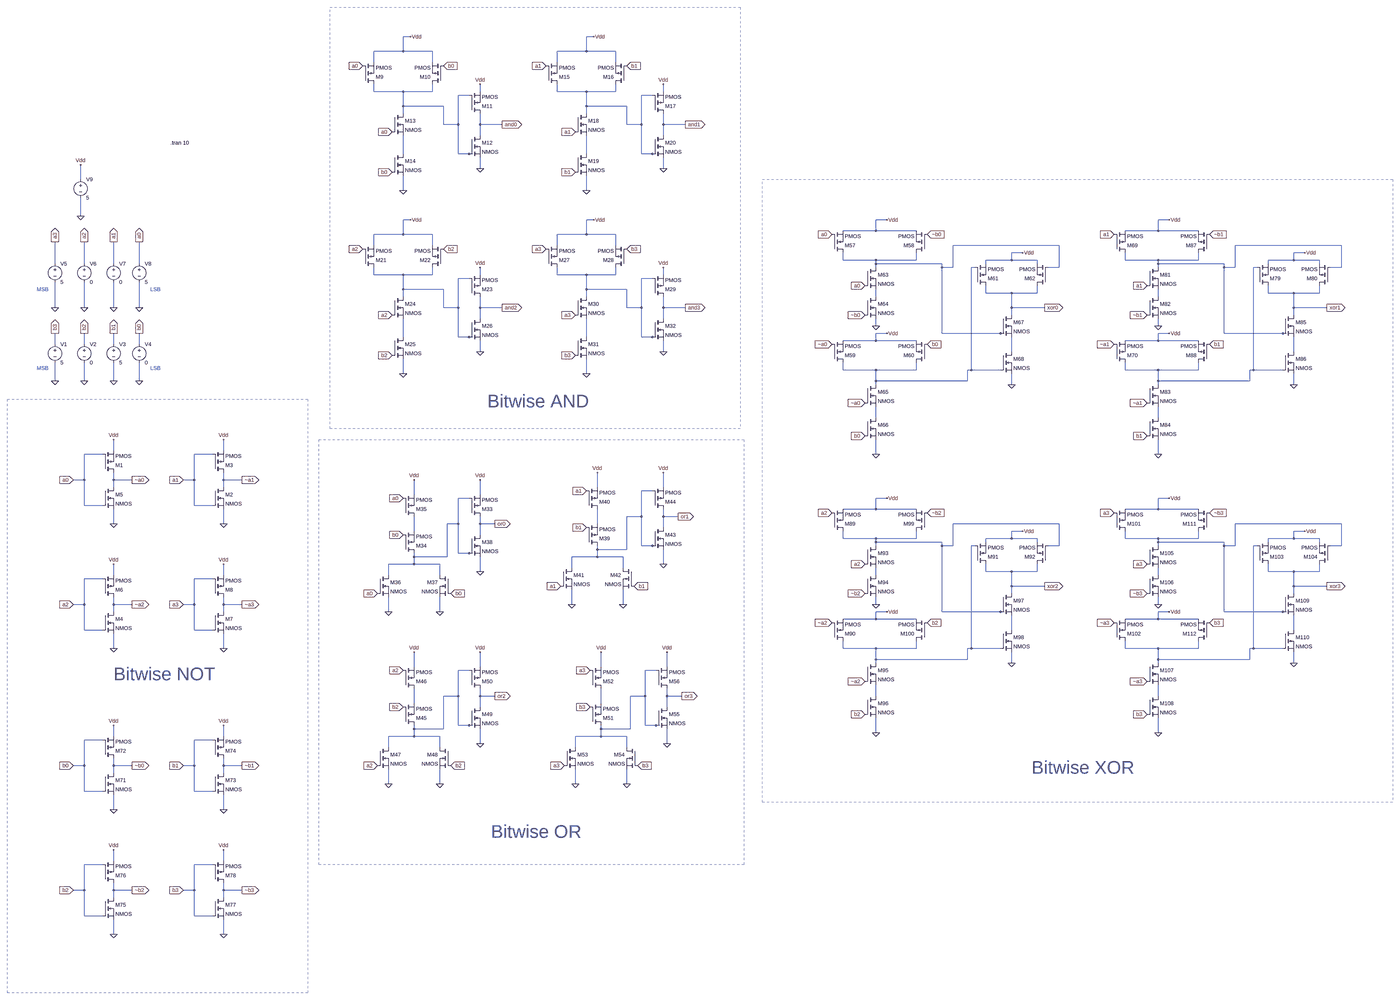
[diagram p0: schematic Bitwise Basic Gate operations.asc, whole sheet]
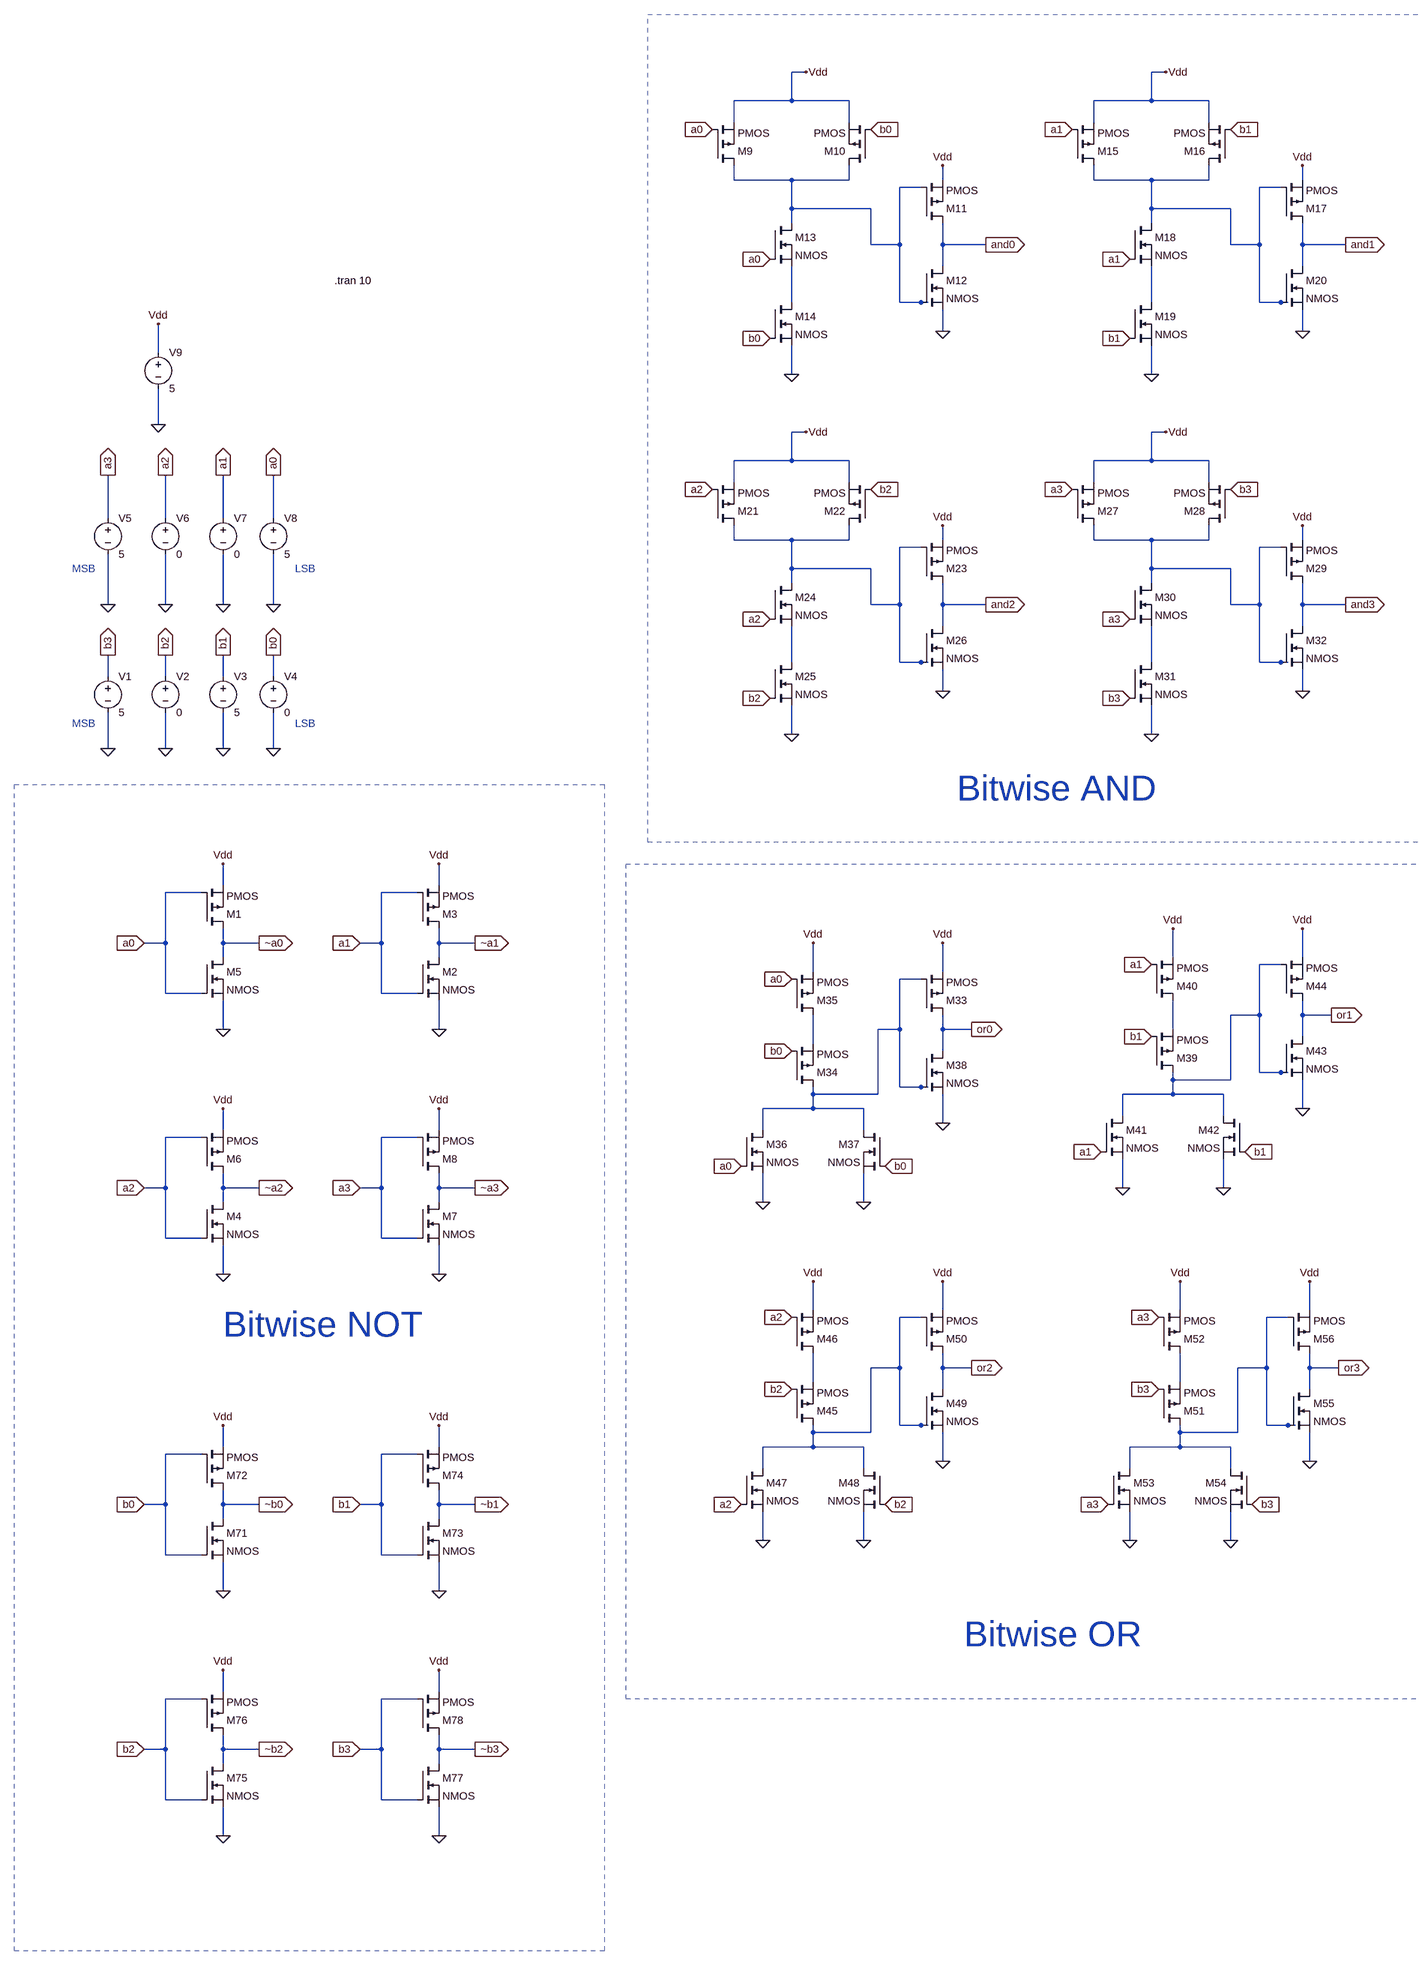
[diagram p1: schematic Bitwise Basic Gate operations.asc, part, row 1 of 1, column 1 of 2]
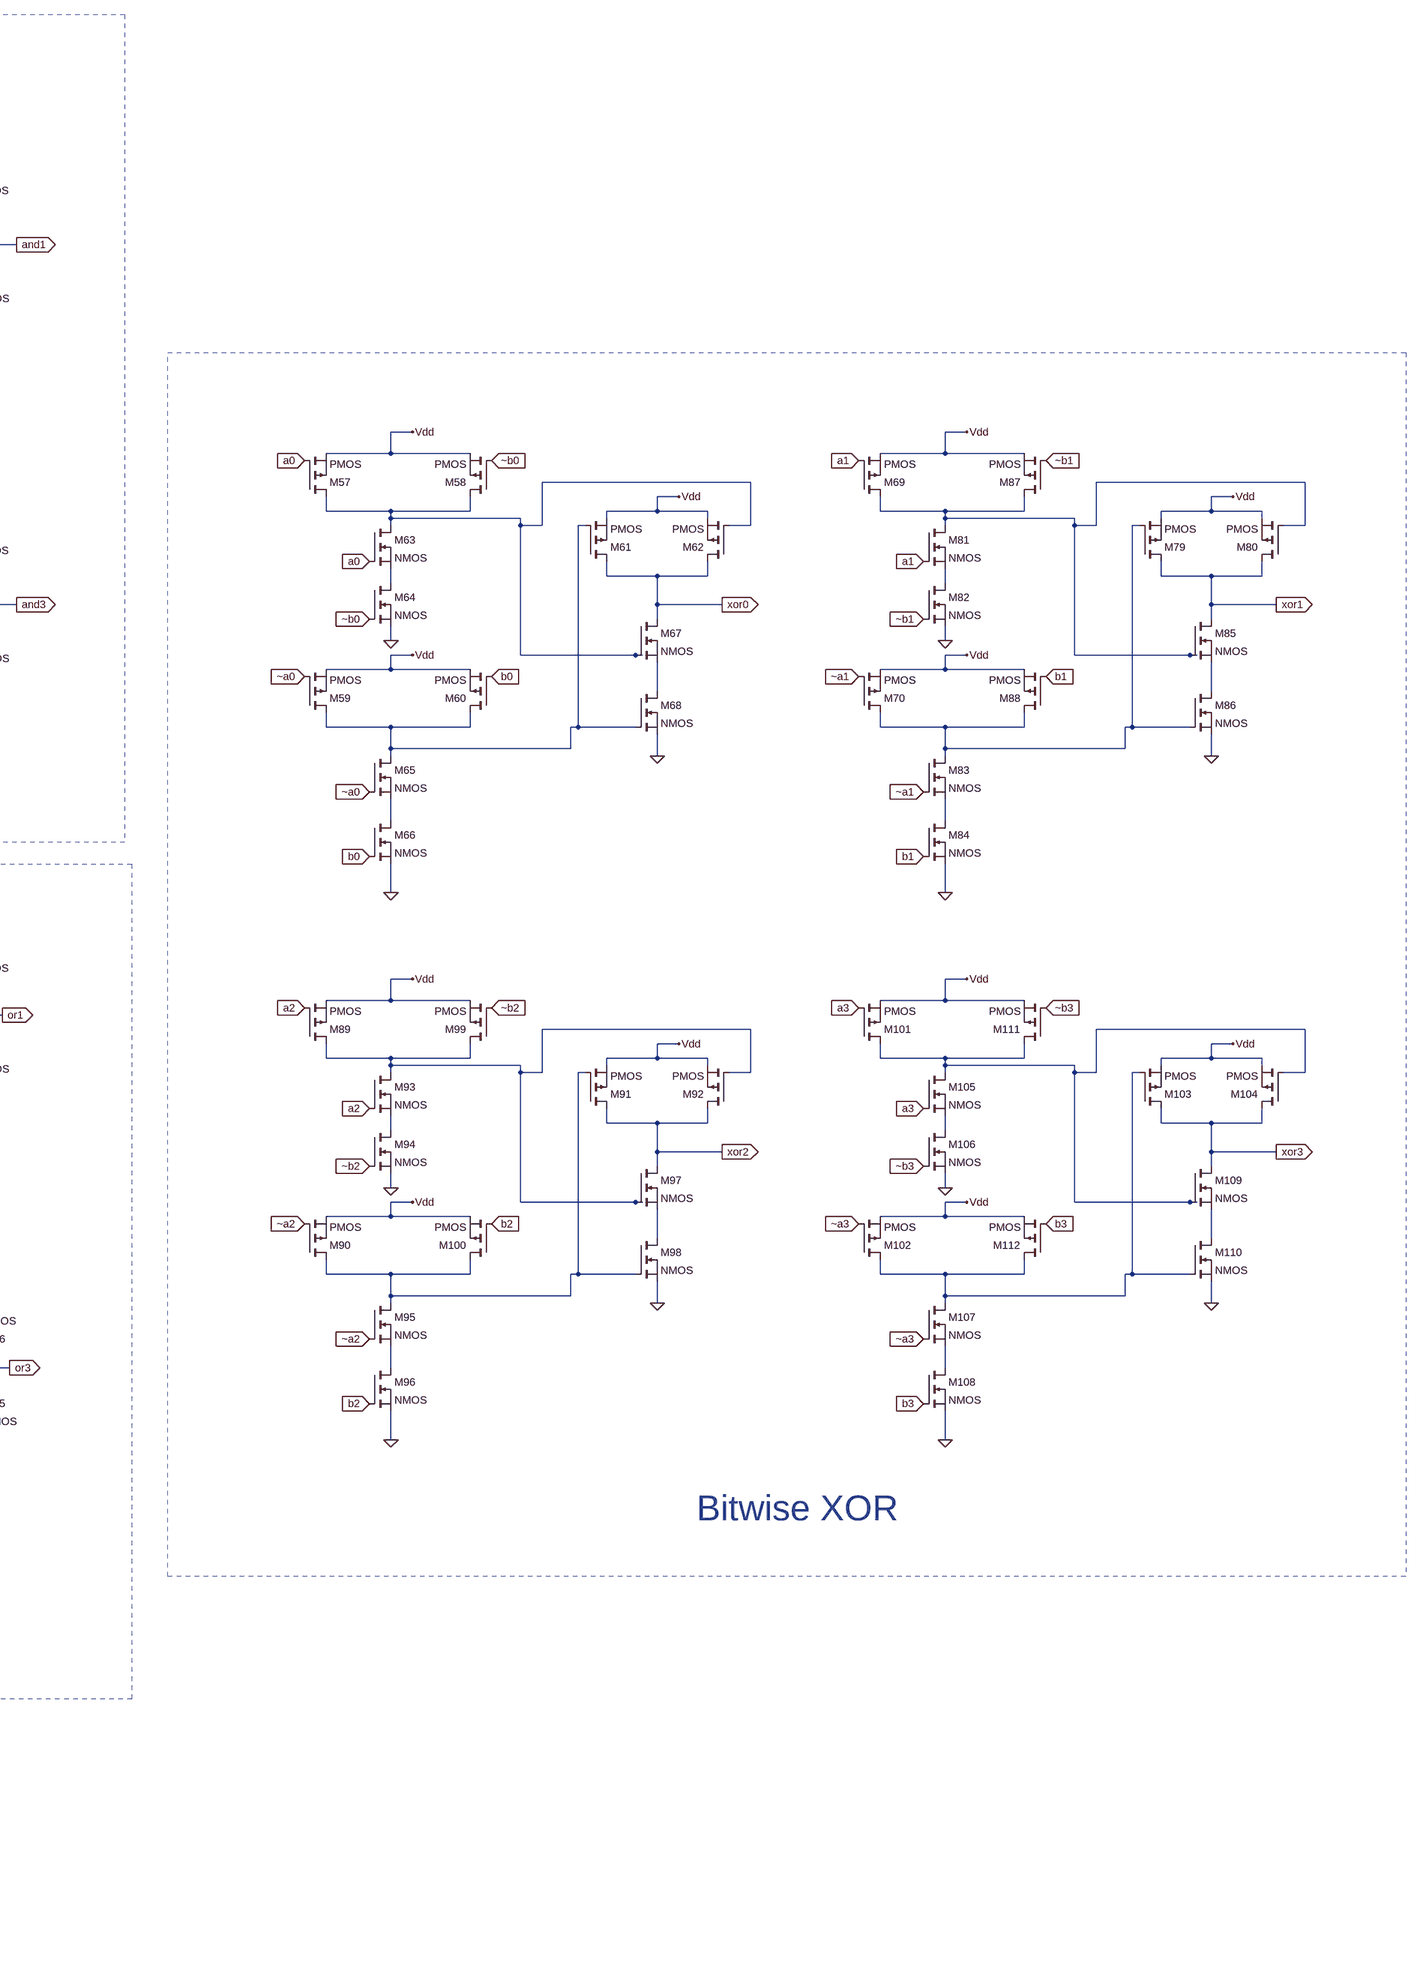
[diagram p2: schematic Bitwise Basic Gate operations.asc, part, row 1 of 1, column 2 of 2]
Bitwise Basic Gate operations.asc, the LTspice schematic file:
Version 4
SHEET 1 6580 2980
WIRE 1504 -1376 1472 -1376
WIRE 2304 -1376 2272 -1376
WIRE 1472 -1312 1472 -1376
WIRE 1472 -1312 1344 -1312
WIRE 1600 -1312 1472 -1312
WIRE 2272 -1312 2272 -1376
WIRE 2272 -1312 2144 -1312
WIRE 2400 -1312 2272 -1312
WIRE 1344 -1264 1344 -1312
WIRE 1600 -1264 1600 -1312
WIRE 2144 -1264 2144 -1312
WIRE 2400 -1264 2400 -1312
WIRE 1344 -1136 1344 -1168
WIRE 1472 -1136 1344 -1136
WIRE 1600 -1136 1600 -1168
WIRE 1600 -1136 1472 -1136
WIRE 1808 -1136 1808 -1168
WIRE 2144 -1136 2144 -1168
WIRE 2272 -1136 2144 -1136
WIRE 2400 -1136 2400 -1168
WIRE 2400 -1136 2272 -1136
WIRE 2608 -1136 2608 -1168
WIRE 1760 -1120 1712 -1120
WIRE 2560 -1120 2512 -1120
WIRE 1472 -1072 1472 -1136
WIRE 1648 -1072 1472 -1072
WIRE 2272 -1072 2272 -1136
WIRE 2448 -1072 2272 -1072
WIRE 1472 -1040 1472 -1072
WIRE 2272 -1040 2272 -1072
WIRE 1648 -992 1648 -1072
WIRE 1712 -992 1712 -1120
WIRE 1712 -992 1648 -992
WIRE 1808 -992 1808 -1040
WIRE 1904 -992 1808 -992
WIRE 2448 -992 2448 -1072
WIRE 2512 -992 2512 -1120
WIRE 2512 -992 2448 -992
WIRE 2608 -992 2608 -1040
WIRE 2704 -992 2608 -992
WIRE 1808 -944 1808 -992
WIRE 2608 -944 2608 -992
WIRE 1472 -864 1472 -944
WIRE 1712 -864 1712 -992
WIRE 1760 -864 1712 -864
WIRE 1776 -864 1760 -864
WIRE 2272 -864 2272 -944
WIRE 2512 -864 2512 -992
WIRE 2560 -864 2512 -864
WIRE 2576 -864 2560 -864
WIRE 1808 -800 1808 -848
WIRE 2608 -800 2608 -848
WIRE 64 -752 64 -816
WIRE 1472 -704 1472 -768
WIRE 2272 -704 2272 -768
WIRE 64 -592 64 -672
WIRE 1504 -576 1472 -576
WIRE 2304 -576 2272 -576
WIRE 3584 -576 3536 -576
WIRE 4816 -576 4768 -576
WIRE 3536 -528 3536 -576
WIRE 3536 -528 3392 -528
WIRE 3712 -528 3536 -528
WIRE 4768 -528 4768 -576
WIRE 4768 -528 4624 -528
WIRE 4944 -528 4768 -528
WIRE 1472 -512 1472 -576
WIRE 1472 -512 1344 -512
WIRE 1600 -512 1472 -512
WIRE 2272 -512 2272 -576
WIRE 2272 -512 2144 -512
WIRE 2400 -512 2272 -512
WIRE 1344 -464 1344 -512
WIRE 1600 -464 1600 -512
WIRE 2144 -464 2144 -512
WIRE 2400 -464 2400 -512
WIRE 4336 -464 3872 -464
WIRE 5568 -464 5104 -464
WIRE 4176 -432 4128 -432
WIRE 5408 -432 5360 -432
WIRE 3392 -400 3392 -432
WIRE 3536 -400 3392 -400
WIRE 3712 -400 3712 -432
WIRE 3712 -400 3536 -400
WIRE 4128 -400 4128 -432
WIRE 4128 -400 4016 -400
WIRE 4240 -400 4128 -400
WIRE 4624 -400 4624 -432
WIRE 4768 -400 4624 -400
WIRE 4944 -400 4944 -432
WIRE 4944 -400 4768 -400
WIRE 5360 -400 5360 -432
WIRE 5360 -400 5248 -400
WIRE 5472 -400 5360 -400
WIRE -48 -384 -48 -480
WIRE 80 -384 80 -480
WIRE 208 -384 208 -480
WIRE 320 -384 320 -480
WIRE 3536 -384 3536 -400
WIRE 3824 -384 3536 -384
WIRE 4016 -384 4016 -400
WIRE 4240 -384 4240 -400
WIRE 4768 -384 4768 -400
WIRE 5056 -384 4768 -384
WIRE 5248 -384 5248 -400
WIRE 5472 -384 5472 -400
WIRE 3536 -368 3536 -384
WIRE 3824 -368 3824 -384
WIRE 3872 -368 3872 -464
WIRE 3872 -368 3824 -368
WIRE 3968 -368 3952 -368
WIRE 4336 -368 4336 -464
WIRE 4336 -368 4288 -368
WIRE 4768 -368 4768 -384
WIRE 5056 -368 5056 -384
WIRE 5104 -368 5104 -464
WIRE 5104 -368 5056 -368
WIRE 5200 -368 5184 -368
WIRE 5568 -368 5568 -464
WIRE 5568 -368 5520 -368
WIRE 1344 -336 1344 -368
WIRE 1472 -336 1344 -336
WIRE 1600 -336 1600 -368
WIRE 1600 -336 1472 -336
WIRE 1808 -336 1808 -368
WIRE 2144 -336 2144 -368
WIRE 2272 -336 2144 -336
WIRE 2400 -336 2400 -368
WIRE 2400 -336 2272 -336
WIRE 2608 -336 2608 -368
WIRE 1760 -320 1712 -320
WIRE 2560 -320 2512 -320
WIRE 1472 -272 1472 -336
WIRE 1648 -272 1472 -272
WIRE 2272 -272 2272 -336
WIRE 2448 -272 2272 -272
WIRE 4016 -256 4016 -288
WIRE 4128 -256 4016 -256
WIRE 4240 -256 4240 -288
WIRE 4240 -256 4128 -256
WIRE 5248 -256 5248 -288
WIRE 5360 -256 5248 -256
WIRE 5472 -256 5472 -288
WIRE 5472 -256 5360 -256
WIRE 1472 -240 1472 -272
WIRE 2272 -240 2272 -272
WIRE 3536 -240 3536 -272
WIRE 4768 -240 4768 -272
WIRE -48 -192 -48 -304
WIRE 80 -192 80 -304
WIRE 208 -192 208 -304
WIRE 320 -192 320 -304
WIRE 1648 -192 1648 -272
WIRE 1712 -192 1712 -320
WIRE 1712 -192 1648 -192
WIRE 1808 -192 1808 -240
WIRE 1904 -192 1808 -192
WIRE 2448 -192 2448 -272
WIRE 2512 -192 2512 -320
WIRE 2512 -192 2448 -192
WIRE 2608 -192 2608 -240
WIRE 2704 -192 2608 -192
WIRE 4128 -192 4128 -256
WIRE 4272 -192 4128 -192
WIRE 5360 -192 5360 -256
WIRE 5504 -192 5360 -192
WIRE 4128 -160 4128 -192
WIRE 5360 -160 5360 -192
WIRE 1808 -144 1808 -192
WIRE 2608 -144 2608 -192
WIRE 3536 -112 3536 -144
WIRE 4768 -112 4768 -144
WIRE 3584 -80 3536 -80
WIRE 3824 -80 3824 -368
WIRE 4080 -80 3824 -80
WIRE 4096 -80 4080 -80
WIRE 4816 -80 4768 -80
WIRE 5056 -80 5056 -368
WIRE 5312 -80 5056 -80
WIRE 5328 -80 5312 -80
WIRE 1472 -64 1472 -144
WIRE 1712 -64 1712 -192
WIRE 1760 -64 1712 -64
WIRE 1776 -64 1760 -64
WIRE 2272 -64 2272 -144
WIRE 2512 -64 2512 -192
WIRE 2560 -64 2512 -64
WIRE 2576 -64 2560 -64
WIRE 3536 -48 3536 -80
WIRE 3536 -48 3392 -48
WIRE 3712 -48 3536 -48
WIRE 4768 -48 4768 -80
WIRE 4768 -48 4624 -48
WIRE 4944 -48 4768 -48
WIRE -48 -32 -48 -80
WIRE 80 -32 80 -80
WIRE 208 -32 208 -80
WIRE 320 -32 320 -80
WIRE 1808 0 1808 -48
WIRE 2608 0 2608 -48
WIRE 4128 0 4128 -64
WIRE 5360 0 5360 -64
WIRE 3392 80 3392 48
WIRE 3536 80 3392 80
WIRE 3712 80 3712 48
WIRE 3712 80 3536 80
WIRE 3952 80 3952 -368
WIRE 3952 80 3936 80
WIRE 4080 80 3952 80
WIRE 4624 80 4624 48
WIRE 4768 80 4624 80
WIRE 4944 80 4944 48
WIRE 4944 80 4768 80
WIRE 5184 80 5184 -368
WIRE 5184 80 5168 80
WIRE 5312 80 5184 80
WIRE 1472 96 1472 32
WIRE 2272 96 2272 32
WIRE -48 128 -48 48
WIRE 80 128 80 48
WIRE 208 128 208 48
WIRE 320 128 320 48
WIRE 3536 128 3536 80
WIRE 3936 128 3936 80
WIRE 3936 128 3536 128
WIRE 4768 128 4768 80
WIRE 5168 128 5168 80
WIRE 5168 128 4768 128
WIRE 3536 144 3536 128
WIRE 4128 144 4128 96
WIRE 4768 144 4768 128
WIRE 5360 144 5360 96
WIRE 3536 288 3536 240
WIRE 4768 288 4768 240
WIRE 208 432 208 384
WIRE 688 432 688 384
WIRE 160 448 80 448
WIRE 640 448 560 448
WIRE 3536 448 3536 384
WIRE 4768 448 4768 384
WIRE 80 560 80 448
WIRE 80 560 32 560
WIRE 208 560 208 528
WIRE 288 560 208 560
WIRE 560 560 560 448
WIRE 560 560 512 560
WIRE 688 560 688 528
WIRE 768 560 688 560
WIRE 208 592 208 560
WIRE 688 592 688 560
WIRE 2320 592 2320 528
WIRE 2608 592 2608 528
WIRE 2560 608 2512 608
WIRE 1520 624 1520 560
WIRE 1808 624 1808 560
WIRE 1760 640 1712 640
WIRE 3584 640 3536 640
WIRE 4816 640 4768 640
WIRE 80 672 80 560
WIRE 160 672 80 672
WIRE 560 672 560 560
WIRE 640 672 560 672
WIRE 3536 688 3536 640
WIRE 3536 688 3392 688
WIRE 3712 688 3536 688
WIRE 4768 688 4768 640
WIRE 4768 688 4624 688
WIRE 4944 688 4768 688
WIRE 2512 720 2512 608
WIRE 2512 720 2448 720
WIRE 2608 720 2608 688
WIRE 2672 720 2608 720
WIRE 208 752 208 688
WIRE 688 752 688 688
WIRE 1712 752 1712 640
WIRE 1712 752 1664 752
WIRE 1808 752 1808 720
WIRE 1872 752 1808 752
WIRE 2320 752 2320 688
WIRE 4336 752 3872 752
WIRE 5568 752 5104 752
WIRE 2608 768 2608 720
WIRE 1520 784 1520 720
WIRE 4176 784 4128 784
WIRE 5408 784 5360 784
WIRE 1808 800 1808 752
WIRE 3392 816 3392 784
WIRE 3536 816 3392 816
WIRE 3712 816 3712 784
WIRE 3712 816 3536 816
WIRE 4128 816 4128 784
WIRE 4128 816 4016 816
WIRE 4240 816 4128 816
WIRE 4624 816 4624 784
WIRE 4768 816 4624 816
WIRE 4944 816 4944 784
WIRE 4944 816 4768 816
WIRE 5360 816 5360 784
WIRE 5360 816 5248 816
WIRE 5472 816 5360 816
WIRE 3536 832 3536 816
WIRE 3824 832 3536 832
WIRE 4016 832 4016 816
WIRE 4240 832 4240 816
WIRE 4768 832 4768 816
WIRE 5056 832 4768 832
WIRE 5248 832 5248 816
WIRE 5472 832 5472 816
WIRE 2512 848 2512 720
WIRE 2560 848 2512 848
WIRE 2576 848 2560 848
WIRE 3536 848 3536 832
WIRE 3824 848 3824 832
WIRE 3872 848 3872 752
WIRE 3872 848 3824 848
WIRE 3968 848 3952 848
WIRE 4336 848 4336 752
WIRE 4336 848 4288 848
WIRE 4768 848 4768 832
WIRE 5056 848 5056 832
WIRE 5104 848 5104 752
WIRE 5104 848 5056 848
WIRE 5200 848 5184 848
WIRE 5568 848 5568 752
WIRE 5568 848 5520 848
WIRE 2320 864 2320 848
WIRE 2448 864 2448 720
WIRE 2448 864 2320 864
WIRE 1712 880 1712 752
WIRE 1760 880 1712 880
WIRE 1776 880 1760 880
WIRE 1520 896 1520 880
WIRE 1664 896 1664 752
WIRE 1664 896 1520 896
WIRE 2320 896 2320 864
WIRE 2320 896 2208 896
WIRE 2432 896 2320 896
WIRE 1520 928 1520 896
WIRE 1520 928 1408 928
WIRE 1632 928 1520 928
WIRE 2608 928 2608 864
WIRE 2208 944 2208 896
WIRE 2432 944 2432 896
WIRE 1808 960 1808 896
WIRE 4016 960 4016 928
WIRE 4128 960 4016 960
WIRE 4240 960 4240 928
WIRE 4240 960 4128 960
WIRE 5248 960 5248 928
WIRE 5360 960 5248 960
WIRE 5472 960 5472 928
WIRE 5472 960 5360 960
WIRE 208 976 208 928
WIRE 688 976 688 928
WIRE 1408 976 1408 928
WIRE 1632 976 1632 928
WIRE 3536 976 3536 944
WIRE 4768 976 4768 944
WIRE 160 992 80 992
WIRE 640 992 560 992
WIRE 4128 1024 4128 960
WIRE 4272 1024 4128 1024
WIRE 5360 1024 5360 960
WIRE 5504 1024 5360 1024
WIRE 4128 1056 4128 1024
WIRE 5360 1056 5360 1024
WIRE 80 1104 80 992
WIRE 80 1104 32 1104
WIRE 208 1104 208 1072
WIRE 288 1104 208 1104
WIRE 560 1104 560 992
WIRE 560 1104 512 1104
WIRE 688 1104 688 1072
WIRE 768 1104 688 1104
WIRE 2208 1104 2208 1040
WIRE 2432 1104 2432 1040
WIRE 3536 1104 3536 1072
WIRE 4768 1104 4768 1072
WIRE 208 1136 208 1104
WIRE 688 1136 688 1104
WIRE 1408 1136 1408 1072
WIRE 1632 1136 1632 1072
WIRE 3584 1136 3536 1136
WIRE 3824 1136 3824 848
WIRE 4080 1136 3824 1136
WIRE 4096 1136 4080 1136
WIRE 4816 1136 4768 1136
WIRE 5056 1136 5056 848
WIRE 5312 1136 5056 1136
WIRE 5328 1136 5312 1136
WIRE 3536 1168 3536 1136
WIRE 3536 1168 3392 1168
WIRE 3712 1168 3536 1168
WIRE 4768 1168 4768 1136
WIRE 4768 1168 4624 1168
WIRE 4944 1168 4768 1168
WIRE 80 1216 80 1104
WIRE 160 1216 80 1216
WIRE 560 1216 560 1104
WIRE 640 1216 560 1216
WIRE 4128 1216 4128 1152
WIRE 5360 1216 5360 1152
WIRE 208 1296 208 1232
WIRE 688 1296 688 1232
WIRE 3392 1296 3392 1264
WIRE 3536 1296 3392 1296
WIRE 3712 1296 3712 1264
WIRE 3712 1296 3536 1296
WIRE 3952 1296 3952 848
WIRE 3952 1296 3936 1296
WIRE 4080 1296 3952 1296
WIRE 4624 1296 4624 1264
WIRE 4768 1296 4624 1296
WIRE 4944 1296 4944 1264
WIRE 4944 1296 4768 1296
WIRE 5184 1296 5184 848
WIRE 5184 1296 5168 1296
WIRE 5312 1296 5184 1296
WIRE 3536 1344 3536 1296
WIRE 3936 1344 3936 1296
WIRE 3936 1344 3536 1344
WIRE 4768 1344 4768 1296
WIRE 5168 1344 5168 1296
WIRE 5168 1344 4768 1344
WIRE 3536 1360 3536 1344
WIRE 4128 1360 4128 1312
WIRE 4768 1360 4768 1344
WIRE 5360 1360 5360 1312
WIRE 1520 1376 1520 1312
WIRE 1808 1376 1808 1312
WIRE 2336 1376 2336 1312
WIRE 2624 1376 2624 1312
WIRE 1760 1392 1712 1392
WIRE 2576 1392 2528 1392
WIRE 1712 1504 1712 1392
WIRE 1712 1504 1648 1504
WIRE 1808 1504 1808 1472
WIRE 1872 1504 1808 1504
WIRE 2528 1504 2528 1392
WIRE 2528 1504 2464 1504
WIRE 2624 1504 2624 1472
WIRE 2688 1504 2624 1504
WIRE 3536 1504 3536 1456
WIRE 4768 1504 4768 1456
WIRE 1520 1536 1520 1472
WIRE 2336 1536 2336 1472
WIRE 1808 1552 1808 1504
WIRE 2624 1552 2624 1504
WIRE 1712 1632 1712 1504
WIRE 1760 1632 1712 1632
WIRE 1776 1632 1760 1632
WIRE 2528 1632 2528 1504
WIRE 2576 1632 2528 1632
WIRE 2592 1632 2576 1632
WIRE 1520 1648 1520 1632
WIRE 1648 1648 1648 1504
WIRE 1648 1648 1520 1648
WIRE 2336 1648 2336 1632
WIRE 2464 1648 2464 1504
WIRE 2464 1648 2336 1648
WIRE 3536 1664 3536 1600
WIRE 4768 1664 4768 1600
WIRE 208 1680 208 1632
WIRE 688 1680 688 1632
WIRE 1520 1680 1520 1648
WIRE 1520 1680 1408 1680
WIRE 1632 1680 1520 1680
WIRE 2336 1680 2336 1648
WIRE 2336 1680 2224 1680
WIRE 2448 1680 2336 1680
WIRE 160 1696 80 1696
WIRE 640 1696 560 1696
WIRE 1808 1712 1808 1648
WIRE 2624 1712 2624 1648
WIRE 1408 1728 1408 1680
WIRE 1632 1728 1632 1680
WIRE 2224 1728 2224 1680
WIRE 2448 1728 2448 1680
WIRE 80 1808 80 1696
WIRE 80 1808 32 1808
WIRE 208 1808 208 1776
WIRE 288 1808 208 1808
WIRE 560 1808 560 1696
WIRE 560 1808 512 1808
WIRE 688 1808 688 1776
WIRE 768 1808 688 1808
WIRE 208 1840 208 1808
WIRE 688 1840 688 1808
WIRE 1408 1888 1408 1824
WIRE 1632 1888 1632 1824
WIRE 2224 1888 2224 1824
WIRE 2448 1888 2448 1824
WIRE 80 1920 80 1808
WIRE 160 1920 80 1920
WIRE 560 1920 560 1808
WIRE 640 1920 560 1920
WIRE 208 2000 208 1936
WIRE 688 2000 688 1936
WIRE 208 2224 208 2176
WIRE 688 2224 688 2176
WIRE 160 2240 80 2240
WIRE 640 2240 560 2240
WIRE 80 2352 80 2240
WIRE 80 2352 32 2352
WIRE 208 2352 208 2320
WIRE 288 2352 208 2352
WIRE 560 2352 560 2240
WIRE 560 2352 512 2352
WIRE 688 2352 688 2320
WIRE 768 2352 688 2352
WIRE 208 2384 208 2352
WIRE 688 2384 688 2352
WIRE 80 2464 80 2352
WIRE 160 2464 80 2464
WIRE 560 2464 560 2352
WIRE 640 2464 560 2464
WIRE 208 2544 208 2480
WIRE 688 2544 688 2480
FLAG -48 128 0
FLAG 80 128 0
FLAG 208 128 0
FLAG 320 128 0
FLAG -48 -192 0
FLAG 80 -192 0
FLAG 208 -192 0
FLAG 320 -192 0
FLAG 64 -592 0
FLAG 64 -816 Vdd
FLAG -48 -480 a3
IOPIN -48 -480 Out
FLAG 80 -480 a2
IOPIN 80 -480 Out
FLAG 208 -480 a1
IOPIN 208 -480 Out
FLAG 320 -480 a0
IOPIN 320 -480 Out
FLAG -48 -80 b3
IOPIN -48 -80 Out
FLAG 80 -80 b2
IOPIN 80 -80 Out
FLAG 208 -80 b1
IOPIN 208 -80 Out
FLAG 320 -80 b0
IOPIN 320 -80 Out
FLAG 208 752 0
FLAG 208 384 Vdd
FLAG 32 560 a0
IOPIN 32 560 In
FLAG 288 560 ~a0
IOPIN 288 560 Out
FLAG 688 752 0
FLAG 688 384 Vdd
FLAG 512 560 a1
IOPIN 512 560 In
FLAG 768 560 ~a1
IOPIN 768 560 Out
FLAG 208 1296 0
FLAG 208 928 Vdd
FLAG 32 1104 a2
IOPIN 32 1104 In
FLAG 288 1104 ~a2
IOPIN 288 1104 Out
FLAG 688 1296 0
FLAG 688 928 Vdd
FLAG 512 1104 a3
IOPIN 512 1104 In
FLAG 768 1104 ~a3
IOPIN 768 1104 Out
FLAG 1472 -704 0
FLAG 1808 -800 0
FLAG 1504 -1376 Vdd
FLAG 1808 -1168 Vdd
FLAG 1296 -1248 a0
IOPIN 1296 -1248 In
FLAG 1424 -960 a0
IOPIN 1424 -960 In
FLAG 1648 -1248 b0
IOPIN 1648 -1248 In
FLAG 1424 -784 b0
IOPIN 1424 -784 In
FLAG 1904 -992 and0
IOPIN 1904 -992 Out
FLAG 2272 -704 0
FLAG 2608 -800 0
FLAG 2304 -1376 Vdd
FLAG 2608 -1168 Vdd
FLAG 2096 -1248 a1
IOPIN 2096 -1248 In
FLAG 2224 -960 a1
IOPIN 2224 -960 In
FLAG 2448 -1248 b1
IOPIN 2448 -1248 In
FLAG 2224 -784 b1
IOPIN 2224 -784 In
FLAG 2704 -992 and1
IOPIN 2704 -992 Out
FLAG 1472 96 0
FLAG 1808 0 0
FLAG 1504 -576 Vdd
FLAG 1808 -368 Vdd
FLAG 1296 -448 a2
IOPIN 1296 -448 In
FLAG 1424 -160 a2
IOPIN 1424 -160 In
FLAG 1648 -448 b2
IOPIN 1648 -448 In
FLAG 1424 16 b2
IOPIN 1424 16 In
FLAG 1904 -192 and2
IOPIN 1904 -192 Out
FLAG 2272 96 0
FLAG 2608 0 0
FLAG 2304 -576 Vdd
FLAG 2608 -368 Vdd
FLAG 2096 -448 a3
IOPIN 2096 -448 In
FLAG 2224 -160 a3
IOPIN 2224 -160 In
FLAG 2448 -448 b3
IOPIN 2448 -448 In
FLAG 2224 16 b3
IOPIN 2224 16 In
FLAG 2704 -192 and3
IOPIN 2704 -192 Out
FLAG 1808 960 0
FLAG 1632 1136 0
FLAG 1408 1136 0
FLAG 1472 640 a0
IOPIN 1472 640 In
FLAG 1360 1056 a0
IOPIN 1360 1056 In
FLAG 1472 800 b0
IOPIN 1472 800 In
FLAG 1680 1056 b0
IOPIN 1680 1056 In
FLAG 1872 752 or0
IOPIN 1872 752 Out
FLAG 1520 560 Vdd
FLAG 1808 560 Vdd
FLAG 2608 928 0
FLAG 2432 1104 0
FLAG 2208 1104 0
FLAG 2272 608 a1
IOPIN 2272 608 In
FLAG 2160 1024 a1
IOPIN 2160 1024 In
FLAG 2272 768 b1
IOPIN 2272 768 In
FLAG 2480 1024 b1
IOPIN 2480 1024 In
FLAG 2672 720 or1
IOPIN 2672 720 Out
FLAG 2320 528 Vdd
FLAG 2608 528 Vdd
FLAG 2624 1712 0
FLAG 2448 1888 0
FLAG 2224 1888 0
FLAG 2288 1392 a3
IOPIN 2288 1392 In
FLAG 2176 1808 a3
IOPIN 2176 1808 In
FLAG 2288 1552 b3
IOPIN 2288 1552 In
FLAG 2496 1808 b3
IOPIN 2496 1808 In
FLAG 2688 1504 or3
IOPIN 2688 1504 Out
FLAG 2336 1312 Vdd
FLAG 2624 1312 Vdd
FLAG 1808 1712 0
FLAG 1632 1888 0
FLAG 1408 1888 0
FLAG 1472 1392 a2
IOPIN 1472 1392 In
FLAG 1360 1808 a2
IOPIN 1360 1808 In
FLAG 1472 1552 b2
IOPIN 1472 1552 In
FLAG 1680 1808 b2
IOPIN 1680 1808 In
FLAG 1872 1504 or2
IOPIN 1872 1504 Out
FLAG 1520 1312 Vdd
FLAG 1808 1312 Vdd
FLAG 3536 -112 0
FLAG 3536 448 0
FLAG 4128 144 0
FLAG 3584 -576 Vdd
FLAG 3584 -80 Vdd
FLAG 4176 -432 Vdd
FLAG 3344 -512 a0
IOPIN 3344 -512 In
FLAG 3488 -288 a0
IOPIN 3488 -288 In
FLAG 3760 -512 ~b0
IOPIN 3760 -512 In
FLAG 3488 -160 ~b0
IOPIN 3488 -160 In
FLAG 3344 -32 ~a0
IOPIN 3344 -32 In
FLAG 3488 224 ~a0
IOPIN 3488 224 In
FLAG 3760 -32 b0
IOPIN 3760 -32 In
FLAG 3488 368 b0
IOPIN 3488 368 In
FLAG 208 2000 0
FLAG 208 1632 Vdd
FLAG 32 1808 b0
IOPIN 32 1808 In
FLAG 288 1808 ~b0
IOPIN 288 1808 Out
FLAG 688 2000 0
FLAG 688 1632 Vdd
FLAG 512 1808 b1
IOPIN 512 1808 In
FLAG 768 1808 ~b1
IOPIN 768 1808 Out
FLAG 208 2544 0
FLAG 208 2176 Vdd
FLAG 32 2352 b2
IOPIN 32 2352 In
FLAG 288 2352 ~b2
IOPIN 288 2352 Out
FLAG 688 2544 0
FLAG 688 2176 Vdd
FLAG 512 2352 b3
IOPIN 512 2352 In
FLAG 768 2352 ~b3
IOPIN 768 2352 Out
FLAG 4272 -192 xor0
IOPIN 4272 -192 Out
FLAG 4768 -112 0
FLAG 4768 448 0
FLAG 5360 144 0
FLAG 4816 -576 Vdd
FLAG 4816 -80 Vdd
FLAG 5408 -432 Vdd
FLAG 4576 -512 a1
IOPIN 4576 -512 In
FLAG 4720 -288 a1
IOPIN 4720 -288 In
FLAG 4992 -512 ~b1
IOPIN 4992 -512 In
FLAG 4720 -160 ~b1
IOPIN 4720 -160 In
FLAG 4576 -32 ~a1
IOPIN 4576 -32 In
FLAG 4720 224 ~a1
IOPIN 4720 224 In
FLAG 4992 -32 b1
IOPIN 4992 -32 In
FLAG 4720 368 b1
IOPIN 4720 368 In
FLAG 5504 -192 xor1
IOPIN 5504 -192 Out
FLAG 3536 1104 0
FLAG 3536 1664 0
FLAG 4128 1360 0
FLAG 3584 640 Vdd
FLAG 3584 1136 Vdd
FLAG 4176 784 Vdd
FLAG 3344 704 a2
IOPIN 3344 704 In
FLAG 3488 928 a2
IOPIN 3488 928 In
FLAG 3760 704 ~b2
IOPIN 3760 704 In
FLAG 3488 1056 ~b2
IOPIN 3488 1056 In
FLAG 3344 1184 ~a2
IOPIN 3344 1184 In
FLAG 3488 1440 ~a2
IOPIN 3488 1440 In
FLAG 3760 1184 b2
IOPIN 3760 1184 In
FLAG 3488 1584 b2
IOPIN 3488 1584 In
FLAG 4272 1024 xor2
IOPIN 4272 1024 Out
FLAG 4768 1104 0
FLAG 4768 1664 0
FLAG 5360 1360 0
FLAG 4816 640 Vdd
FLAG 4816 1136 Vdd
FLAG 5408 784 Vdd
FLAG 4576 704 a3
IOPIN 4576 704 In
FLAG 4720 928 a3
IOPIN 4720 928 In
FLAG 4992 704 ~b3
IOPIN 4992 704 In
FLAG 4720 1056 ~b3
IOPIN 4720 1056 In
FLAG 4576 1184 ~a3
IOPIN 4576 1184 In
FLAG 4720 1440 ~a3
IOPIN 4720 1440 In
FLAG 4992 1184 b3
IOPIN 4992 1184 In
FLAG 4720 1584 b3
IOPIN 4720 1584 In
FLAG 5504 1024 xor3
IOPIN 5504 1024 Out
SYMBOL voltage -48 -48 R0
SYMATTR InstName V1
SYMATTR Value 5
SYMBOL voltage 80 -48 R0
SYMATTR InstName V2
SYMATTR Value 0
SYMBOL voltage 208 -48 R0
SYMATTR InstName V3
SYMATTR Value 5
SYMBOL voltage 320 -48 R0
SYMATTR InstName V4
SYMATTR Value 0
SYMBOL voltage -48 -400 R0
SYMATTR InstName V5
SYMATTR Value 5
SYMBOL voltage 80 -400 R0
WINDOW 123 0 0 Left 0
WINDOW 39 0 0 Left 0
SYMATTR InstName V6
SYMATTR Value 0
SYMBOL voltage 208 -400 R0
SYMATTR InstName V7
SYMATTR Value 0
SYMBOL voltage 320 -400 R0
SYMATTR InstName V8
SYMATTR Value 5
SYMBOL voltage 64 -768 R0
SYMATTR InstName V9
SYMATTR Value 5
SYMBOL nmos 160 592 R0
SYMATTR InstName M5
SYMBOL pmos 160 528 M180
SYMATTR InstName M1
SYMBOL nmos 640 592 R0
SYMATTR InstName M2
SYMBOL pmos 640 528 M180
SYMATTR InstName M3
SYMBOL nmos 160 1136 R0
SYMATTR InstName M4
SYMBOL pmos 160 1072 M180
SYMATTR InstName M6
SYMBOL nmos 640 1136 R0
SYMATTR InstName M7
SYMBOL pmos 640 1072 M180
SYMATTR InstName M8
SYMBOL pmos 1296 -1168 M180
SYMATTR InstName M9
SYMBOL pmos 1648 -1168 R180
SYMATTR InstName M10
SYMBOL pmos 1760 -1040 M180
SYMATTR InstName M11
SYMBOL nmos 1424 -1040 R0
SYMATTR InstName M13
SYMBOL nmos 1424 -864 R0
SYMATTR InstName M14
SYMBOL nmos 1760 -944 R0
SYMATTR InstName M12
SYMBOL pmos 2096 -1168 M180
SYMATTR InstName M15
SYMBOL pmos 2448 -1168 R180
SYMATTR InstName M16
SYMBOL pmos 2560 -1040 M180
SYMATTR InstName M17
SYMBOL nmos 2224 -1040 R0
SYMATTR InstName M18
SYMBOL nmos 2224 -864 R0
SYMATTR InstName M19
SYMBOL nmos 2560 -944 R0
SYMATTR InstName M20
SYMBOL pmos 1296 -368 M180
SYMATTR InstName M21
SYMBOL pmos 1648 -368 R180
SYMATTR InstName M22
SYMBOL pmos 1760 -240 M180
SYMATTR InstName M23
SYMBOL nmos 1424 -240 R0
SYMATTR InstName M24
SYMBOL nmos 1424 -64 R0
SYMATTR InstName M25
SYMBOL nmos 1760 -144 R0
SYMATTR InstName M26
SYMBOL pmos 2096 -368 M180
SYMATTR InstName M27
SYMBOL pmos 2448 -368 R180
SYMATTR InstName M28
SYMBOL pmos 2560 -240 M180
SYMATTR InstName M29
SYMBOL nmos 2224 -240 R0
SYMATTR InstName M30
SYMBOL nmos 2224 -64 R0
SYMATTR InstName M31
SYMBOL nmos 2560 -144 R0
SYMATTR InstName M32
SYMBOL pmos 1472 880 M180
SYMATTR InstName M34
SYMBOL pmos 1472 720 M180
SYMATTR InstName M35
SYMBOL nmos 1360 976 R0
SYMATTR InstName M36
SYMBOL nmos 1680 976 M0
SYMATTR InstName M37
SYMBOL nmos 1760 800 R0
SYMATTR InstName M38
SYMBOL pmos 1760 720 M180
SYMATTR InstName M33
SYMBOL pmos 2272 848 M180
SYMATTR InstName M39
SYMBOL pmos 2272 688 M180
SYMATTR InstName M40
SYMBOL nmos 2160 944 R0
SYMATTR InstName M41
SYMBOL nmos 2480 944 M0
SYMATTR InstName M42
SYMBOL nmos 2560 768 R0
SYMATTR InstName M43
SYMBOL pmos 2560 688 M180
SYMATTR InstName M44
SYMBOL pmos 2288 1632 M180
SYMATTR InstName M51
SYMBOL pmos 2288 1472 M180
SYMATTR InstName M52
SYMBOL nmos 2176 1728 R0
SYMATTR InstName M53
SYMBOL nmos 2496 1728 M0
SYMATTR InstName M54
SYMBOL nmos 2576 1552 R0
SYMATTR InstName M55
SYMBOL pmos 2576 1472 M180
SYMATTR InstName M56
SYMBOL pmos 1472 1632 M180
SYMATTR InstName M45
SYMBOL pmos 1472 1472 M180
SYMATTR InstName M46
SYMBOL nmos 1360 1728 R0
SYMATTR InstName M47
SYMBOL nmos 1680 1728 M0
SYMATTR InstName M48
SYMBOL nmos 1760 1552 R0
SYMATTR InstName M49
SYMBOL pmos 1760 1472 M180
SYMATTR InstName M50
SYMBOL pmos 3344 -432 M180
SYMATTR InstName M57
SYMBOL pmos 3344 48 M180
SYMATTR InstName M59
SYMBOL pmos 3968 -288 M180
SYMATTR InstName M61
SYMBOL pmos 4288 -288 R180
SYMATTR InstName M62
SYMBOL nmos 3488 -368 R0
SYMATTR InstName M63
SYMBOL nmos 3488 -240 R0
SYMATTR InstName M64
SYMBOL nmos 3488 144 R0
SYMATTR InstName M65
SYMBOL nmos 3488 288 R0
SYMATTR InstName M66
SYMBOL nmos 4080 -160 R0
SYMATTR InstName M67
SYMBOL nmos 4080 0 R0
SYMATTR InstName M68
SYMBOL pmos 3760 -432 R180
SYMATTR InstName M58
SYMBOL pmos 3760 48 R180
SYMATTR InstName M60
SYMBOL nmos 160 1840 R0
SYMATTR InstName M71
SYMBOL pmos 160 1776 M180
SYMATTR InstName M72
SYMBOL nmos 640 1840 R0
SYMATTR InstName M73
SYMBOL pmos 640 1776 M180
SYMATTR InstName M74
SYMBOL nmos 160 2384 R0
SYMATTR InstName M75
SYMBOL pmos 160 2320 M180
SYMATTR InstName M76
SYMBOL nmos 640 2384 R0
SYMATTR InstName M77
SYMBOL pmos 640 2320 M180
SYMATTR InstName M78
SYMBOL pmos 4576 -432 M180
SYMATTR InstName M69
SYMBOL pmos 4576 48 M180
SYMATTR InstName M70
SYMBOL pmos 5200 -288 M180
SYMATTR InstName M79
SYMBOL pmos 5520 -288 R180
SYMATTR InstName M80
SYMBOL nmos 4720 -368 R0
SYMATTR InstName M81
SYMBOL nmos 4720 -240 R0
SYMATTR InstName M82
SYMBOL nmos 4720 144 R0
SYMATTR InstName M83
SYMBOL nmos 4720 288 R0
SYMATTR InstName M84
SYMBOL nmos 5312 -160 R0
SYMATTR InstName M85
SYMBOL nmos 5312 0 R0
SYMATTR InstName M86
SYMBOL pmos 4992 -432 R180
SYMATTR InstName M87
SYMBOL pmos 4992 48 R180
SYMATTR InstName M88
SYMBOL pmos 3344 784 M180
SYMATTR InstName M89
SYMBOL pmos 3344 1264 M180
SYMATTR InstName M90
SYMBOL pmos 3968 928 M180
SYMATTR InstName M91
SYMBOL pmos 4288 928 R180
SYMATTR InstName M92
SYMBOL nmos 3488 848 R0
SYMATTR InstName M93
SYMBOL nmos 3488 976 R0
SYMATTR InstName M94
SYMBOL nmos 3488 1360 R0
SYMATTR InstName M95
SYMBOL nmos 3488 1504 R0
SYMATTR InstName M96
SYMBOL nmos 4080 1056 R0
SYMATTR InstName M97
SYMBOL nmos 4080 1216 R0
SYMATTR InstName M98
SYMBOL pmos 3760 784 R180
SYMATTR InstName M99
SYMBOL pmos 3760 1264 R180
SYMATTR InstName M100
SYMBOL pmos 4576 784 M180
SYMATTR InstName M101
SYMBOL pmos 4576 1264 M180
SYMATTR InstName M102
SYMBOL pmos 5200 928 M180
SYMATTR InstName M103
SYMBOL pmos 5520 928 R180
SYMATTR InstName M104
SYMBOL nmos 4720 848 R0
SYMATTR InstName M105
SYMBOL nmos 4720 976 R0
SYMATTR InstName M106
SYMBOL nmos 4720 1360 R0
SYMATTR InstName M107
SYMBOL nmos 4720 1504 R0
SYMATTR InstName M108
SYMBOL nmos 5312 1056 R0
SYMATTR InstName M109
SYMBOL nmos 5312 1216 R0
SYMATTR InstName M110
SYMBOL pmos 4992 784 R180
SYMATTR InstName M111
SYMBOL pmos 4992 1264 R180
SYMATTR InstName M112
TEXT 368 -272 Left 2 ;LSB
TEXT 368 72 Left 2 ;LSB
TEXT -128 -272 Left 2 ;MSB
TEXT -128 72 Left 2 ;MSB
TEXT 208 1408 Left 6 ;Bitwise NOT
TEXT 1840 216 Left 6 ;Bitwise AND
TEXT 456 -912 Left 2 !.tran 10
TEXT 1856 2096 Left 6 ;Bitwise OR
TEXT 4216 1816 Left 6 ;Bitwise XOR
RECTANGLE Normal 2944 336 1152 -1504 2
RECTANGLE Normal 2960 2240 1104 384 2
RECTANGLE Normal 1056 2800 -256 208 2
RECTANGLE Normal 5792 1968 3040 -752 2

The netlist it stands for:
* Bitwise Basic Gate operations.asc
V1 b3 0 5
V2 b2 0 0
V3 b1 0 5
V4 b0 0 0
V5 a3 0 5
V6 a2 0 0
V7 a1 0 0
V8 a0 0 5
V9 Vdd 0 5
M5 ~a0 a0 0 0 NMOS
M1 ~a0 a0 Vdd Vdd PMOS
M2 ~a1 a1 0 0 NMOS
M3 ~a1 a1 Vdd Vdd PMOS
M4 ~a2 a2 0 0 NMOS
M6 ~a2 a2 Vdd Vdd PMOS
M7 ~a3 a3 0 0 NMOS
M8 ~a3 a3 Vdd Vdd PMOS
M9 N001 a0 Vdd Vdd PMOS
M10 N001 b0 Vdd Vdd PMOS
M11 and0 N001 Vdd Vdd PMOS
M13 N001 a0 N003 N003 NMOS
M14 N003 b0 0 0 NMOS
M12 and0 N001 0 0 NMOS
M15 N002 a1 Vdd Vdd PMOS
M16 N002 b1 Vdd Vdd PMOS
M17 and1 N002 Vdd Vdd PMOS
M18 N002 a1 N004 N004 NMOS
M19 N004 b1 0 0 NMOS
M20 and1 N002 0 0 NMOS
M21 N009 a2 Vdd Vdd PMOS
M22 N009 b2 Vdd Vdd PMOS
M23 and2 N009 Vdd Vdd PMOS
M24 N009 a2 N013 N013 NMOS
M25 N013 b2 0 0 NMOS
M26 and2 N009 0 0 NMOS
M27 N010 a3 Vdd Vdd PMOS
M28 N010 b3 Vdd Vdd PMOS
M29 and3 N010 Vdd Vdd PMOS
M30 N010 a3 N014 N014 NMOS
M31 N014 b3 0 0 NMOS
M32 and3 N010 0 0 NMOS
M34 N020 b0 N024 N024 PMOS
M35 N024 a0 Vdd Vdd PMOS
M36 N020 a0 0 0 NMOS
M37 N020 b0 0 0 NMOS
M38 or0 N020 0 0 NMOS
M33 or0 N020 Vdd Vdd PMOS
M39 N019 b1 N021 N021 PMOS
M40 N021 a1 Vdd Vdd PMOS
M41 N019 a1 0 0 NMOS
M42 N019 b1 0 0 NMOS
M43 or1 N019 0 0 NMOS
M44 or1 N019 Vdd Vdd PMOS
M51 N032 b3 N036 N036 PMOS
M52 N036 a3 Vdd Vdd PMOS
M53 N032 a3 0 0 NMOS
M54 N032 b3 0 0 NMOS
M55 or3 N032 0 0 NMOS
M56 or3 N032 Vdd Vdd PMOS
M45 N031 b2 N035 N035 PMOS
M46 N035 a2 Vdd Vdd PMOS
M47 N031 a2 0 0 NMOS
M48 N031 b2 0 0 NMOS
M49 or2 N031 0 0 NMOS
M50 or2 N031 Vdd Vdd PMOS
M57 N005 a0 Vdd Vdd PMOS
M59 N007 ~a0 Vdd Vdd PMOS
M61 xor0 N007 Vdd Vdd PMOS
M62 xor0 N005 Vdd Vdd PMOS
M63 N005 a0 N011 N011 NMOS
M64 N011 ~b0 0 0 NMOS
M65 N007 ~a0 N017 N017 NMOS
M66 N017 b0 0 0 NMOS
M67 xor0 N005 N015 N015 NMOS
M68 N015 N007 0 0 NMOS
M58 N005 ~b0 Vdd Vdd PMOS
M60 N007 b0 Vdd Vdd PMOS
M71 ~b0 b0 0 0 NMOS
M72 ~b0 b0 Vdd Vdd PMOS
M73 ~b1 b1 0 0 NMOS
M74 ~b1 b1 Vdd Vdd PMOS
M75 ~b2 b2 0 0 NMOS
M76 ~b2 b2 Vdd Vdd PMOS
M77 ~b3 b3 0 0 NMOS
M78 ~b3 b3 Vdd Vdd PMOS
M69 N006 a1 Vdd Vdd PMOS
M70 N008 ~a1 Vdd Vdd PMOS
M79 xor1 N008 Vdd Vdd PMOS
M80 xor1 N006 Vdd Vdd PMOS
M81 N006 a1 N012 N012 NMOS
M82 N012 ~b1 0 0 NMOS
M83 N008 ~a1 N018 N018 NMOS
M84 N018 b1 0 0 NMOS
M85 xor1 N006 N016 N016 NMOS
M86 N016 N008 0 0 NMOS
M87 N006 ~b1 Vdd Vdd PMOS
M88 N008 b1 Vdd Vdd PMOS
M89 N022 a2 Vdd Vdd PMOS
M90 N025 ~a2 Vdd Vdd PMOS
M91 xor2 N025 Vdd Vdd PMOS
M92 xor2 N022 Vdd Vdd PMOS
M93 N022 a2 N027 N027 NMOS
M94 N027 ~b2 0 0 NMOS
M95 N025 ~a2 N033 N033 NMOS
M96 N033 b2 0 0 NMOS
M97 xor2 N022 N029 N029 NMOS
M98 N029 N025 0 0 NMOS
M99 N022 ~b2 Vdd Vdd PMOS
M100 N025 b2 Vdd Vdd PMOS
M101 N023 a3 Vdd Vdd PMOS
M102 N026 ~a3 Vdd Vdd PMOS
M103 xor3 N026 Vdd Vdd PMOS
M104 xor3 N023 Vdd Vdd PMOS
M105 N023 a3 N028 N028 NMOS
M106 N028 ~b3 0 0 NMOS
M107 N026 ~a3 N034 N034 NMOS
M108 N034 b3 0 0 NMOS
M109 xor3 N023 N030 N030 NMOS
M110 N030 N026 0 0 NMOS
M111 N023 ~b3 Vdd Vdd PMOS
M112 N026 b3 Vdd Vdd PMOS
.model NMOS NMOS
.model PMOS PMOS
.lib standard.mos
* LSB
* LSB
* MSB
* MSB
* Bitwise NOT
* Bitwise AND
.tran 10
* Bitwise OR
* Bitwise XOR
.backanno
.end